# Altium schematic sheet RasCNC_board.SchDoc: RP2040 CNC
size C; Author: AM; CompanyName: Expatria Technologies; DrawnBy: A.Marles; Engineer: AM; Organization: Expatria Technolgoies; Address1: Schematic; DocumentNumber: 11; SheetNumber: 11; SheetTotal: 13
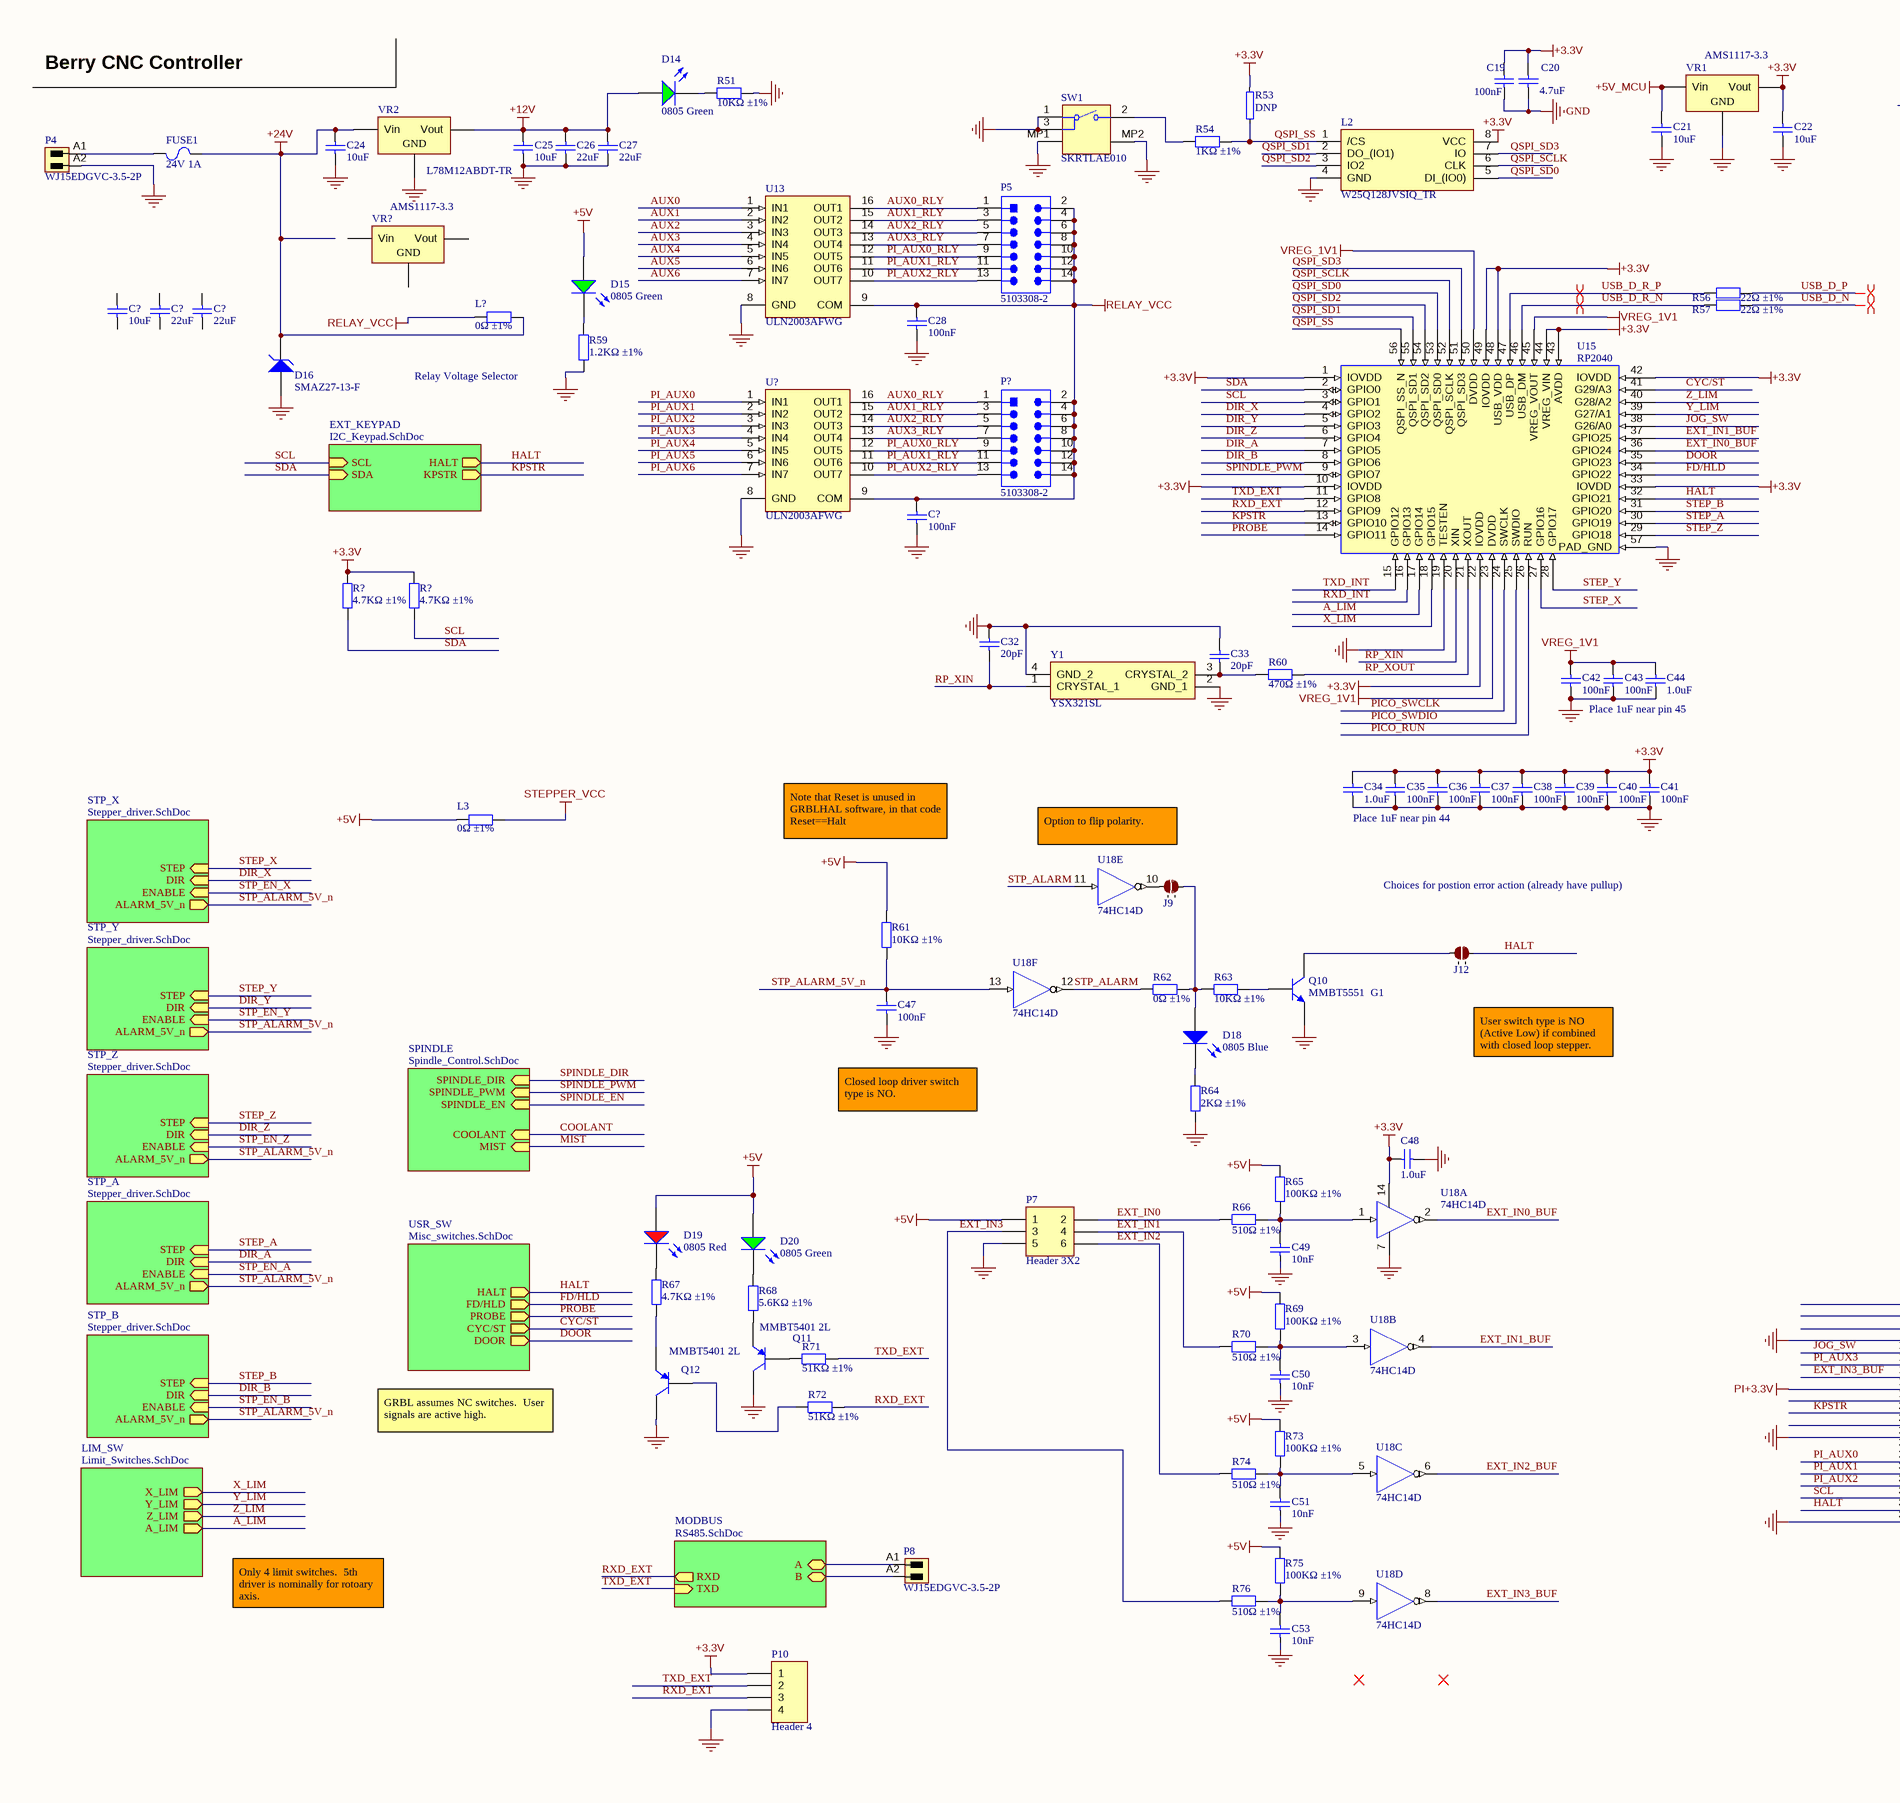
[diagram p0: RasCNC_board.SchDoc, left]
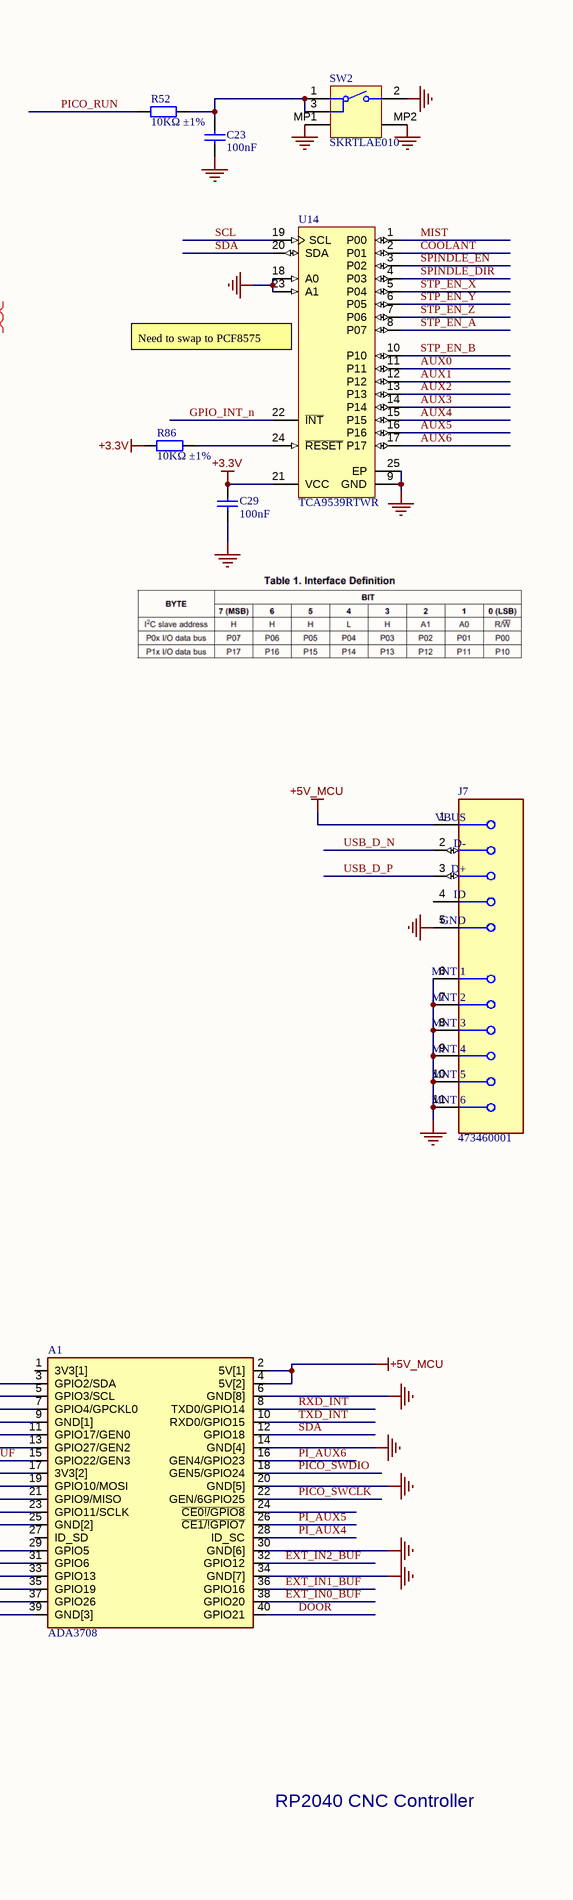
[diagram p1: RasCNC_board.SchDoc, right]

## Parts
(Parts that share a designator on the sheet are numbered #1, #2 ... from top to bottom, then left to right.)
A1  ADA3708  [ADA3708_RPI-ZERO]
C19  100nF  [0402_C]
C20  4.7uF  [0402_C]
C21  10uF  [1206_C]
C22  10uF  [1206_C]
C23  100nF  [0402_C]
C24  10uF  [1206_C]
C25  10uF  [1206_C]
C26  22uF  [0805_C]
C27  22uF  [0805_C]
C28  100nF  [0603_C]
C29  100nF  [0402_C]
C32  20pF  [0402_C]
C33  20pF  [0402_C]
C34  1.0uF  [0402_C]
C35  100nF  [0402_C]
C36  100nF  [0402_C]
C37  100nF  [0402_C]
C38  100nF  [0402_C]
C39  100nF  [0402_C]
C40  100nF  [0402_C]
C41  100nF  [0402_C]
C42  100nF  [0402_C]
C43  100nF  [0402_C]
C44  1.0uF  [0402_C]
C47  100nF  [0402_C]
C48  1.0uF  [0402_C]
C49  10nF  [0402_C]
C50  10nF  [0402_C]
C51  10nF  [0402_C]
C53  10nF  [0402_C]
C?#1  10uF  [1206_C]
C?#2  22uF  [0805_C]
C?#3  22uF  [0805_C]
C?#4  100nF  [0603_C]
D14  0805 Green  [0805_LED_S1]
D15  0805 Green  [0805_LED_S1]
D16  SMAZ27-13-F  [DIOM5226X240N]
D18  0805 Blue  [0805_LED_S1]
D19  0805 Red  [0805_LED_S1]
D20  0805 Green  [0805_LED_S1]
FUSE1  24V 1A  [1206_C]
J7  473460001  [FP-473460001-MFG]
J9  2 way net solder junction - Normally Open  [2waySolder_NO]  (value not drawn)  (no BOM)
J12  2 way net solder junction - Normally Open  [2waySolder_NO]  (value not drawn)  (no BOM)
L2  W25Q128JVSIQ_TR  [SOIC127P780X195-8N]
L3  0Ω ±1%  [0402_R]
L?  0Ω ±1%  [0402_R]
P4  WJ15EDGVC-3.5-2P  [SL_3_50_180G_02]
P5  5103308-2  [TECO-5103308-2_V]
P7  Header 3X2  [HDR2X3]
P8  WJ15EDGVC-3.5-2P  [SL_3_50_180G_02]
P10  Header 4  [HDR1X4]
P?  5103308-2  [TECO-5103308-2_V]
Q10  MMBT5551  G1  [SOT-23(SOT-23-3)]
Q11  MMBT5401 2L  [SOT-23(SOT-23-3)]
Q12  MMBT5401 2L  [SOT-23(SOT-23-3)]
R51  10KΩ ±1%  [0402_R]
R52  10KΩ ±1%  [0402_R]
R53  DNP  [0402]
R54  1KΩ ±1%  [0402_R]
R56  22Ω ±1%  [0402_R]
R57  22Ω ±1%  [0402_R]
R59  1.2KΩ ±1%  [0402_R]
R60  470Ω ±1%  [0402_R]
R61  10KΩ ±1%  [0402_R]
R62  0Ω ±1%  [0402_R]
R63  10KΩ ±1%  [0402_R]
R64  2KΩ ±1%  [0402_R]
R65  100KΩ ±1%  [0402_R]
R66  510Ω ±1%  [0402_R]
R67  4.7KΩ ±1%  [0402_R]
R68  5.6KΩ ±1%  [0402_R]
R69  100KΩ ±1%  [0402_R]
R70  510Ω ±1%  [0402_R]
R71  51KΩ ±1%  [0402_R]
R72  51KΩ ±1%  [0402_R]
R73  100KΩ ±1%  [0402_R]
R74  510Ω ±1%  [0402_R]
R75  100KΩ ±1%  [0402_R]
R76  510Ω ±1%  [0402_R]
R86  10KΩ ±1%  [0402_R]
R?#1  4.7KΩ ±1%  [0402_R]
R?#2  4.7KΩ ±1%  [0402_R]
SW1  SKRTLAE010  [ALPS-SKRTLAE010_V]
SW2  SKRTLAE010  [ALPS-SKRTLAE010_V]
U13  ULN2003AFWG  [SOIC-16_150mil]
U14  TCA9539RTWR  [RTW0024B_V]
U15  RP2040  [RP2040]
U18  74HC14D  [SOIC-14_150mil]  (parts A,B,C,D,E,F of 6)
U?  ULN2003AFWG  [SOIC-16_150mil]
VR1  AMS1117-3.3  [SOT-223]
VR2  L78M12ABDT-TR  [TO-252-2-180]
VR?  AMS1117-3.3  [SOT-223]
Y1  YSX321SL  [YSX321SL]

## Sub-sheets
EXT_KEYPAD = I2C_Keypad.SchDoc: HALT (out), SCL (in), KPSTR (out), SDA (in)
LIM_SW = Limit_Switches.SchDoc: Y_LIM (out), Z_LIM (out), X_LIM (out), A_LIM (out)
MODBUS = RS485.SchDoc: A (bidir), B (bidir), RXD (out), TXD (in)
SPINDLE = Spindle_Control.SchDoc: COOLANT (in), MIST (in), SPINDLE_EN (in), SPINDLE_DIR (in), SPINDLE_PWM (in)
STP_A = Stepper_driver.SchDoc: ALARM_5V_n (out), STEP (in), DIR (in), ENABLE (in)
STP_B = Stepper_driver.SchDoc: ALARM_5V_n (out), STEP (in), DIR (in), ENABLE (in)
STP_X = Stepper_driver.SchDoc: ALARM_5V_n (out), STEP (in), DIR (in), ENABLE (in)
STP_Y = Stepper_driver.SchDoc: ALARM_5V_n (out), STEP (in), DIR (in), ENABLE (in)
STP_Z = Stepper_driver.SchDoc: ALARM_5V_n (out), STEP (in), DIR (in), ENABLE (in)
USR_SW = Misc_switches.SchDoc: HALT (out), FD/HLD (out), PROBE (out), CYC/ST (out), DOOR (out)

## Nets
+3.3V: C19.2 C20.2 C22.2 C29.2 C34.2 C35.2 C36.2 C37.2 C38.2 C39.2 C40.2 C41.2 C48.1 L2.8(VCC) P10.1 R53.2 R86.2 R?#1.2 R?#2.2 U14.21(VCC) U15.1(IOVDD) U15.10(IOVDD) U15.22(IOVDD) U15.33(IOVDD) U15.42(IOVDD) U15.43(AVDD) U15.44(VREG_VIN) U15.48(USB_VDD) U15.49(IOVDD) U18.14(VDD) VR1.2(Vout)
+5V: D15.A D19.A D20.A L3.1 P7.1 R61.2 R65.2 R69.2 R73.2 R75.2
+5V_MCU: A1.2(5V[1]) A1.4(5V[2]) C21.2 J7.1(VBUS) VR1.3(Vin)
+12V: C25.2 C26.2 C27.2 D14.A VR2.3(Vout)
+24V: C24.2 D16.2(K) FUSE1.2 L?.2 VR2.1(Vin)
GND: A1.6(GND[8]) A1.9(GND[1]) A1.14(GND[4]) A1.20(GND[5]) A1.25(GND[2]) A1.30(GND[6]) A1.34(GND[7]) A1.39(GND[3]) C19.1 C20.1 C21.1 C22.1 C23.1 C24.1 C25.1 C26.1 C27.1 C28.1 C29.1 C32.2 C33.2 C34.1 C35.1 C36.1 C37.1 C38.1 C39.1 C40.1 C41.1 C42.1 C43.1 C44.1 C47.1 C48.2 C49.1 C50.1 C51.1 C53.1 C?#4.1 D16.1(A) J7.5(GND) J7.6(MNT_1) J7.7(MNT_2) J7.8(MNT_3) J7.9(MNT_4) J7.10(MNT_5) J7.11(MNT_6) L2.4(GND) P4.A2 P7.5 P10.4 Q10.2(E) Q11.3(C) Q12.3(C) R51.1 R59.1 R64.1 SW1.1 SW1.3 SW1.MP1 SW1.MP2 SW2.2 SW2.MP1 SW2.MP2 U13.8(GND) U14.9(GND) U14.18(A0) U14.23(A1) U14.25(EP) U15.19(TESTEN) U15.57(PAD_GND) U18.7(GND) U?.8(GND) VR1.1(GND) VR2.2(GND) Y1.2(GND_1) Y1.4(GND_2)
PI+3.3V: A1.17(3V3[2])
RELAY_VCC: C28.2 C?#4.2 L?.1 P5.2 P5.4 P5.6 P5.8 P5.10 P5.12 P5.14 P?.2 P?.4 P?.6 P?.8 P?.10 P?.12 P?.14 U13.9(COM) U?.9(COM)
STEPPER_VCC: L3.2
VREG_1V1: C42.2 C43.2 C44.2 U15.23(DVDD) U15.45(VREG_VOUT) U15.50(DVDD)
A_LIM: U15.17(GPIO14) ; sheet LIM_SW/A_LIM
AUX0: U13.1(IN1) U14.11(P11)
AUX0_RLY: P5.1 P?.1 U13.16(OUT1) U?.16(OUT1)
AUX1: U13.2(IN2) U14.12(P12)
AUX1_RLY: P5.3 P?.3 U13.15(OUT2) U?.15(OUT2)
AUX2: U13.3(IN3) U14.13(P13)
AUX2_RLY: P5.5 P?.5 U13.14(OUT3) U?.14(OUT3)
AUX3: U13.4(IN4) U14.14(P14)
AUX3_RLY: P5.7 P?.7 U13.13(OUT4) U?.13(OUT4)
AUX4: U13.5(IN5) U14.15(P15)
AUX5: U13.6(IN6) U14.16(P16)
AUX6: U13.7(IN7) U14.17(P17)
COOLANT: U14.2(P01) ; sheet SPINDLE/COOLANT
CYC/ST: U15.41(G29/A3) ; sheet USR_SW/CYC/ST
DIR_A: U15.7(GPIO5) ; sheet STP_A/DIR
DIR_B: U15.8(GPIO6) ; sheet STP_B/DIR
DIR_X: U15.4(GPIO2) ; sheet STP_X/DIR
DIR_Y: U15.5(GPIO3) ; sheet STP_Y/DIR
DIR_Z: U15.6(GPIO4) ; sheet STP_Z/DIR
DOOR: A1.40(GPIO21) U15.35(GPIO23) ; sheet USR_SW/DOOR
EXT_IN0: P7.2 R66.1
EXT_IN0_BUF: A1.38(GPIO20) U15.36(GPIO24) U18.2(Y)
EXT_IN1: P7.4 R70.1
EXT_IN1_BUF: A1.36(GPIO16) U15.37(GPIO25) U18.4(Y)
EXT_IN2: P7.6 R74.1
EXT_IN2_BUF: A1.32(GPIO12) U18.6(Y)
EXT_IN3: P7.3 R76.1
EXT_IN3_BUF: A1.15(GPIO22/GEN3) U18.8(Y)
FD/HLD: U15.34(GPIO22) ; sheet USR_SW/FD/HLD
GPIO_INT_n: U14.22(~{INT})
HALT: A1.37(GPIO26) J12.2 U15.32(GPIO21) ; sheet USR_SW/HALT, sheet EXT_KEYPAD/HALT
JOG_SW: A1.11(GPIO17/GEN0) U15.38(G26/A0)
KPSTR: A1.21(GPIO9/MISO) U15.13(GPIO10) ; sheet EXT_KEYPAD/KPSTR
MIST: U14.1(P00) ; sheet SPINDLE/MIST
PI_AUX0: A1.29(GPIO5) U?.1(IN1)
PI_AUX0_RLY: P5.9 P?.9 U13.12(OUT5) U?.12(OUT5)
PI_AUX1: A1.31(GPIO6) U?.2(IN2)
PI_AUX1_RLY: P5.11 P?.11 U13.11(OUT6) U?.11(OUT6)
PI_AUX2: A1.33(GPIO13) U?.3(IN3)
PI_AUX2_RLY: P5.13 P?.13 U13.10(OUT7) U?.10(OUT7)
PI_AUX3: A1.13(GPIO27/GEN2) U?.4(IN4)
PI_AUX4: A1.28(ID_SC) U?.5(IN5)
PI_AUX5: A1.26(~{CE1/!GPIO7}) U?.6(IN6)
PI_AUX6: A1.16(GEN4/GPIO23) U?.7(IN7)
PICO_RUN: R52.2 U15.26(RUN)
PICO_SWCLK: A1.22(GEN/6GPIO25) U15.24(SWCLK)
PICO_SWDIO: A1.18(GEN5/GPIO24) U15.25(SWDIO)
PROBE: U15.14(GPIO11) ; sheet USR_SW/PROBE
QSPI_SCLK: L2.6(CLK) U15.52(QSPI_SCLK)
QSPI_SD0: L2.5(DI_(IO0)) U15.53(QSPI_SD0)
QSPI_SD1: L2.2(DO_(IO1)) U15.55(QSPI_SD1)
QSPI_SD2: L2.3(IO2) U15.54(QSPI_SD2)
QSPI_SD3: L2.7(IO) U15.51(QSPI_SD3)
QSPI_SS: L2.1(/CS) R53.1 R54.2 U15.56(QSPI_SS_N)
RP_XIN: C32.1 U15.20(XIN) Y1.1(CRYSTAL_1)
RP_XOUT: R60.2 U15.21(XOUT)
RXD_EXT: P10.3 R72.1 U15.12(GPIO9) ; sheet MODBUS/RXD
RXD_INT: A1.8(TXD0/GPIO14) U15.16(GPIO13)
SCL: A1.35(GPIO19) R?#2.1 U14.19(SCL) U15.3(GPIO1) ; sheet EXT_KEYPAD/SCL
SDA: A1.12(GPIO18) R?#1.1 U14.20(SDA) U15.2(GPIO0) ; sheet EXT_KEYPAD/SDA
SPINDLE_DIR: U14.4(P03) ; sheet SPINDLE/SPINDLE_DIR
SPINDLE_EN: U14.3(P02) ; sheet SPINDLE/SPINDLE_EN
SPINDLE_PWM: U15.9(GPIO7) ; sheet SPINDLE/SPINDLE_PWM
STEP_A: U15.30(GPIO19) ; sheet STP_A/STEP
STEP_B: U15.31(GPIO20) ; sheet STP_B/STEP
STEP_X: U15.27(GPIO16) ; sheet STP_X/STEP
STEP_Y: U15.28(GPIO17) ; sheet STP_Y/STEP
STEP_Z: U15.29(GPIO18) ; sheet STP_Z/STEP
STP_ALARM: R62.2 U18.11(A) U18.12(Y)
STP_ALARM_5V_n: C47.2 R61.1 U18.13(A) ; sheet STP_X/ALARM_5V_n, sheet STP_Y/ALARM_5V_n, sheet STP_Z/ALARM_5V_n, sheet STP_A/ALARM_5V_n, sheet STP_B/ALARM_5V_n
STP_EN_A: U14.8(P07) ; sheet STP_A/ENABLE
STP_EN_B: U14.10(P10) ; sheet STP_B/ENABLE
STP_EN_X: U14.5(P04) ; sheet STP_X/ENABLE
STP_EN_Y: U14.6(P05) ; sheet STP_Y/ENABLE
STP_EN_Z: U14.7(P06) ; sheet STP_Z/ENABLE
TXD_EXT: P10.2 R71.2 U15.11(GPIO8) ; sheet MODBUS/TXD
TXD_INT: A1.10(RXD0/GPIO15) U15.15(GPIO12)
USB_D_N: J7.2(D-) R57.1
USB_D_P: J7.3(D+) R56.1
USB_D_R_N: R57.2 U15.46(USB_DM)
USB_D_R_P: R56.2 U15.47(USB_DP)
X_LIM: U15.18(GPIO15) ; sheet LIM_SW/X_LIM
Y_LIM: U15.39(G27/A1) ; sheet LIM_SW/Y_LIM
Z_LIM: U15.40(G28/A2) ; sheet LIM_SW/Z_LIM
NetC23_2: C23.2 R52.1 SW2.1 SW2.3
NetC33_1: C33.1 R60.1 Y1.3(CRYSTAL_2)
NetC49_2: C49.2 R65.1 R66.2 U18.1(A)
NetC50_2: C50.2 R69.1 R70.2 U18.3(A)
NetC51_2: C51.2 R73.1 R74.2 U18.5(A)
NetC53_2: C53.2 R75.1 R76.2 U18.9(A)
NetD14_K: D14.K R51.2
NetD15_K: D15.K R59.2
NetD18_A: D18.A J9.2 R62.1 R63.1
NetD18_K: D18.K R64.2
NetD19_K: D19.K R67.2
NetD20_K: D20.K R68.2
NetFUSE1_1: FUSE1.1 P4.A1
NetJ9_1: J9.1 U18.10(Y)
NetJ12_1: J12.1 Q10.3(C)
NetP8_A1: P8.A1 ; sheet MODBUS/A
NetP8_A2: P8.A2 ; sheet MODBUS/B
NetQ10_1: Q10.1(B) R63.2
NetQ11_1: Q11.1(B) R71.1
NetQ11_2: Q11.2(E) R68.1
NetQ12_1: Q12.1(B) R72.2
NetQ12_2: Q12.2(E) R67.1
NetR54_1: R54.1 SW1.2
NetR86_1: R86.1 U14.24(~{RESET})

Not connected (* = marked no-connect by the designer): A1 1(3V3[1]) 3(GPIO2/SDA) 5(GPIO3/SCL) 7(GPIO4/GPCKL0) 19(GPIO10/MOSI) 23(GPIO11/SCLK) 24(~{CE0!/GPIO8}) 27(ID_SD); C?#1 1 2; C?#2 1 2; C?#3 1 2; J7 4(ID); VR? 1(GND) 2(Vout) 3(Vin)

## Layout directives
differential pair: USB_D_N, USB_D_P, USB_D_R_N, USB_D_R_P

## Notes on the sheet
- Berry CNC Controller
- (near U14) Need to swap to PCF8575
- Relay Voltage Selector
- Place 1uF near pin 45
- Note that Reset is unused in GRBLHAL software, in that code Reset==Halt
- Option to flip polarity.
- Place 1uF near pin 44
- Choices for postion error action (already have pullup)
- User switch type is NO (Active Low) if combined with closed loop stepper.
- Closed loop driver switch type is NO.
- GRBL assumes NC switches.  User signals are active high.
- Only 4 limit switches.  5th driver is nominally for rotoary axis.
- RP2040 CNC Controller
- Expatria Technologies
- SHEET
- PROJECT
- REV
- 1136 Glade Court
- Port Coquitlam, BC V3B 1R5
- EMAIL: INFO@EXPATRIA.CA
- SIZE
- ENGR
- C
- MODIFIED
- DOCUMENT
- /
- Copyright Expatria Technologies 2021.  This document describes Open Hardware and is licensed under the CERN-OHL-P  v2.  No warranty is implied or expressed.

## Library data of the parts
A1 = ADA3708: Raspberry Pi Zero WH _Zero W with Headers_; MP: ADA3708; Availability: Unavailable; Package: None; MF: Raspberry Pi; Value: *; Price: None; SnapEDA_Link: https://www.snapeda.com/parts/ADA3708/Raspberry%20Pi/view-part/2770118/?ref=snap
C19 C23 C29 C35-C43 C47 = 0402 100nF (104) 10% 16V: Chip capacitors; Manufacturer: Samsung Electro-Mechanics; PartNumber: CL05B104KO5NNNC; Tolerance: 10%; Voltage: 16V; ComponentLink1Description: Supplier link; ComponentLink1URL: http://www.szlcsc.com/product/details_1877.html; Package: 0402; Supplier: LC; SuppliersPartNumber: C1525; Capacitance: 100nF
C20 = 0402 4.7uF (475) 20% 10V: Chip capacitor; Manufacturer: Samsung Electro-Mechanics; PartNumber: CL05A475MP5NRNC; Tolerance: 20%; Voltage: 10V; ComponentLink1Description: Supplier link; ComponentLink1URL: http://www.szlcsc.com/product/details_24469.html; Package: 0402; Supplier: LC; SuppliersPartNumber: C23733; Capacitance: 4.7uF
C21 C22 C24 C25 C?#1 = 1206 10uF (106) 10% 50V: Chip capacitors; Manufacturer: Samsung Electro-Mechanics; PartNumber: CL31A106KBHNNNE; Tolerance: 10%; Voltage: 50V; ComponentLink1Description: Supplier link; ComponentLink1URL: http://www.szlcsc.com/product/details_14236.html; Package: 1206; Supplier: LC; SuppliersPartNumber: C13585; Capacitance: 10uF
C26 C27 C?#2 C?#3 = 0805 22uF (226) 20% 25V: Chip capacitors; Manufacturer: Samsung Electro-Mechanics; PartNumber: CL21A226MAQNNNE; Tolerance: 20%; Voltage: 25V; ComponentLink1Description: Supplier link; ComponentLink1URL: http://www.szlcsc.com/product/details_46786.html; Package: 0805; Supplier: LC; SuppliersPartNumber: C45783; Capacitance: 22uF
C28 C?#4 = 0603 100nF (104) 10% 50V: Chip capacitors; Manufacturer: YAGEO; PartNumber: CC0603KRX7R9BB104; Tolerance: 10%; Voltage: 50V; ComponentLink1Description: Supplier link; ComponentLink1URL: http://www.szlcsc.com/product/details_15331.html; Package: 0603; Supplier: LC; SuppliersPartNumber: C14663; Capacitance: 100nF
C32 C33 = 0402 20pF (200) 5% 50V: Chip capacitors; Manufacturer: Guangdong Fenghua Advanced Tech; PartNumber: 0402CG200J500NT; Tolerance: 5%; Voltage: 50V; ComponentLink1Description: Supplier link; ComponentLink1URL: http://www.szlcsc.com/product/details_1906.html; Package: 0402; Supplier: LC; SuppliersPartNumber: C1554; Capacitance: 20pF
C34 C44 C48 = 0402 1.0uF (105) 10% 25V: Chip capacitor; Manufacturer: Samsung Electro-Mechanics; PartNumber: CL05A105KA5NQNC; Capacitance: 1uF; Tolerance: 10%; Voltage: 25V; ComponentLink1Description: Supplier link; ComponentLink1URL: http://www.szlcsc.com/product/details_53938.html; Package: 0402; Supplier: LC; SuppliersPartNumber: C52923
C49-C51 C53 = 0402 10nF (103) 10% 50V: Chip capacitors; Manufacturer: Samsung Electro-Mechanics; PartNumber: CL05B103KB5NNNC; Tolerance: 10%; Voltage: 50V; ComponentLink1Description: Supplier link; ComponentLink1URL: http://www.szlcsc.com/product/details_15869.html; Package: 0402; Supplier: LC; SuppliersPartNumber: C15195; Capacitance: 10nF
D14 D15 D20 = 0805 LED Green: LED; ComponentLink1Description: 供应商链接; ComponentLink1URL: http://www.szlcsc.com/product/details_2670.html; Package: 0805; Supplier: LC; SuppliersPartNumber: C2297; Color: Green
D16 = BZT52C27: 27V ±5% 1W 500nA @ 20.5V SMA(DO-214AC) Zener Diodes RoHS; ComponentLink1Description: 供应商链接; ComponentLink1URL: http://www.szlcsc.com/product/details_8541.html; Package: SMA(DO-214AC); Supplier: LC; SuppliersPartNumber: C155318
D18 = 0805 LED Blue: LED; ComponentLink1Description: 供应商链接; ComponentLink1URL: http://www.szlcsc.com/product/details_2666.html; Package: 0805; Supplier: LC; SuppliersPartNumber: C2293; Color: Blue
D19 = 0805 LED Red: LED; PartNumber: FC-2012HRK-620D; Manufacturer: Foshan NationStar Optoelectronics; ComponentLink1Description: 供应商链接; ComponentLink1URL: http://www.szlcsc.com/product/details_2668.html; Package: 0805; Supplier: LC; SuppliersPartNumber: C84256; Color: Red
FUSE1 = JK-nSMD050-24: 24V 1A 0.1s 1206 PTC Resettable Fuses RoHS; Manufacturer: Jinrui Electronic Materials Co.; Package: 1206; Supplier: LC; SuppliersPartNumber: C369160; PartNumber: JK-nSMD050-24
J7 = CMP-2000-05246-2: CONN RCPT USB2.0 MICRO B SMD R/A; Manufacturer: Molex; Conn Orientation: Right Angle; Is Female: yes; Shielding: true; Pitch: 0.65mm; Number Of Contacts: 5; Voltage Rating: 30V; Current Rating: 1.8A; Device Class L2: USB Connectors; Digikey Description: CONN RCPT USB2.0 MICRO B SMD R/A; Height: 2.945mm; RoHS: TRUE; ComponentLink2Description: Datasheet; Octopart: https://octopart.com/47346-0001-molex-7164928; Automotive: No; Package: 0; Category: Conn; Device Class L1: Connectors; Usb Standard: USB 2.0; Temperature: -30°C to +85°C; Temperature Range Low: -30°C; Footprint Url: https://www.molex.com/pdm_docs/sd/473460001_sd.pdf; ComponentLink2URL: https://www.molex.com/webdocs/datasheets/pdf/en-us/0473460001_IO_CONNECTORS.pdf; Lead Free: Yes; Manufacturer Part Number: 473460001; Contact Material: Gold,Nickel; Temperature Range High: +85°C; Device Class L3: unset; SuppliersPartNumber: C132560
J9 J12 = 2waySolderNO: ComponentLink1URL: http://www.edatools.cz/addons; ComponentLink1Description: Source
L2 = W25Q128JVSIQ_TR: Inductor; Manufacturer_Name: Winbond; Manufacturer_Part_Number: W25Q128JVSIQ TR; Datasheet Link: http://www.winbond.com/resource-files/w25q128jv%20spi%20revc%2011162016.pdf; Height: 1.95mm; Mouser Part Number: 454-W25Q128JVSIQTR; Mouser Price/Stock: https://www.mouser.co.uk/ProductDetail/Winbond/W25Q128JVSIQ-TR?qs=qSfuJ%252Bfl%2Fd7vTyLA9kNdGw%3D%3D; Arrow Part Number: W25Q128JVSIQ TR; Arrow Price/Stock: https://www.arrow.com/en/products/w25q128jvsiqtr/winbond-electronics?region=nac; SuppliersPartNumber: C97521
L3 L? R62 = 0402 0R (0R0) 1%: Chip resistor; Manufacturer: Uniroyal Elec; PartNumber: 0402WGF0000TCE; Power: 1/16W; Package: 0402; Supplier: LC; SuppliersPartNumber: C17168; ComponentLink1Description: Supplier link; ComponentLink1URL: http://www.szlcsc.com/product/details_17853.html; Resistance: 0Ω; Tolerance: 1%
P4 P8 = CMP-1559-00901-1: Header,Male Pin,Covered(4 Sided) 2 1 0.138"（3.50mm） 2 P=3.5mm Pluggable System Terminal Block RoHS; Manufacturer: Weidmueller; UL_94_flammability_rating: V-0; Pitch_mm: 3.5 mm; Side_termination_characteristic: closed side; Pitch_inch: 0.138 inch; Solder_pin_length_mm: 3.2 mm; Short_text_for_material: SL 3.50/02/180G 3.2SN OR BX; ComponentLink1Description: Manufacturer URL; ComponentLink1URL: http://www.weidmueller.com/; PartNumber: WJ15EDGVC-3.5-2P; Revision: V1; PackageReference: SL_3_50_180G_02; Packaging: Box
P5 P? = CMP-2000-05623-1: Male Header, Pitch 2.54 mm, 2 x 7 Position, Height 9.8552 mm, Tail Length 3.048 mm, -65 to 105 degC, RoHS, Rail/Tube; Manufacturer: TE Connectivity; Featured Product: AMP-LATCHRibbonCableConnectors; Mating Products: 1658527-5-ND / -CONNRCPT14POS.100POLARGOLD / 1658526-9-ND / -CONNRCPT14POSVERTGOLDW/SR / 1658526-8-ND / -CONNRCPT14POSVERTGOLD / ASC14B-ND / -CONNIDCSOCKET14POSGOLD / ASC14H-ND / -CONNIDCSOCKET14POS15GOLD / AKC14B-ND / -CONNIDCSKT14POSW/POLGOLD / AKC14H-ND / -CONNIDCSKT14POSW/POL15GOLD / 487223-2-ND / -014HOUSINGFFCRCPT100CLDR; Other Names: A33161; Number of Positions: 14; Dynamic Catalog: AMP-LatchSeries; Catalog Drawings: LowProfileShroudedStraight; Pitch: 0.100"(2.54mm); 3D Model: 5103308-2.pdf; Connector Type: Header,Shrouded; Number of Positions Loaded: All; RoHS Information: 5103308-2StatementofCompliance; Datasheet URL: http://www.te.com/commerce/DocumentDelivery/DDEController?Action=srchrtrv&DocNm=5103308&DocType=Customer+Drawing&DocLang=English&DocFormat=pdf&PartCntxt=5103308-2; Mounting Type: ThroughHole; Packaging: Tube; Standard Package: 100; Category: Connectors,Interconnects; Number of Rows: 2; Package Description: Male Header, Pitch 2.54 mm, 2 x 7 Position, Height 9.8552 mm, Tail Length 3.048 mm; Termination: Solder; Contact Mating Length: 0.240"(6.10mm); Color: Black; Contact Finish: GoldorGold-Palladium; Manufacturer URL: http://www.te.com/; Family: RectangularConnectors-Headers,MalePins; Row Spacing: 0.100"(2.54mm); Package Reference: 5103308-2; Contact Type: MalePin; Contact Finish Thickness: 15µin(0.38µm); Mounting Technology: ThroughHole; Series: AMP-Latch; Datasheet Version: Rev. E, 03/2011
P7 = Header 3X2: Header, 3-Pin, Dual row; Publisher: Altium Limited
P10 = Header 4: Header, 4-Pin; Publisher: Altium Limited
Q10 = SOT-23 MMBT5551  G1: 三极管; ComponentLink1Description: 供应商链接; ComponentLink1URL: http://www.szlcsc.com/product/details_2502.html; Package: SOT-23; Supplier: LC; SuppliersPartNumber: C2145
Q11 Q12 = SOT-23 MMBT5401 2L: 三极管; ComponentLink1Description: 供应商链接; ComponentLink1URL: http://www.szlcsc.com/product/details_8818.html; Package: SOT-23; Supplier: LC; SuppliersPartNumber: C8326
R51 R52 R61 R63 R86 = 0402 10K (1002) 1%: Chip resistor; Manufacturer: Uniroyal Elec; PartNumber: 0402WGF1002TCE; Power: 1/16W; ComponentLink1Description: Supplier link; ComponentLink1URL: http://www.szlcsc.com/product/details_26487.html; Package: 0402; Supplier: LC; SuppliersPartNumber: C25744; Resistance: 10KΩ; Tolerance: 1%
R53 = RES: Resistor, ±5%, 0.05W; Part Number: R0201-0R; Part number IPS: 00000003245; Value: 0R; Note: Chip Res 5%; Artikkelnr Noca: N.A.; Manufacturer: *; Manufacturer Part Number: *; ComponentLink1URL: *; ComponentLink1Description: Datasheet; ComponentLink2URL: *; ComponentLink2Description: Supplier link; HelpURL: *; Footprint Doc: 0201; LatestRevisionDate: 2017-11-09; Pin Count: 2; Publisher: Nordic Semiconductor; Published: 2014-11-13; Supplier 1: *; Supplier Part Number 1: *; Supplier 2: *; Supplier Part Number 2: *
R54 = 0402 1K (1001) 1%: Chip resistor; Manufacturer: Uniroyal Elec; PartNumber: 0402WGF1001TCE; Power: 1/16W; ComponentLink1Description: Supplier link; ComponentLink1URL: http://www.szlcsc.com/product/details_12256.html; Package: 0402; Supplier: LC; SuppliersPartNumber: C11702; Resistance: 1KΩ; Tolerance: 1%
R56 R57 = 0402 22R (22R0) 1%: Chip resistor; Manufacturer: Uniroyal Elec; PartNumber: 0402WGF220JTCE; Power: 1/16W; ComponentLink1Description: Supplier link; ComponentLink1URL: http://www.szlcsc.com/product/details_25835.html; Package: 0402; Supplier: LC; SuppliersPartNumber: C25092; Resistance: 22Ω; Tolerance: 1%
R59 = 0402 1.2K (1201) 1%: Chip resistor; Manufacturer: Uniroyal Elec; PartNumber: 0402WGF1201TCE; Power: 1/16W; ComponentLink1Description: Supplier link; ComponentLink1URL: http://www.szlcsc.com/product/details_26605.html; Package: 0402; Supplier: LC; SuppliersPartNumber: C25862; Resistance: 1.2KΩ; Tolerance: 1%
R60 = 0402 470R (4700) 1%: Chip resistor; Manufacturer: Uniroyal Elec; PartNumber: 0402WGF4700TCE; Power: 1/16W; ComponentLink1Description: Supplier link; ComponentLink1URL: http://www.szlcsc.com/product/details_25860.html; Package: 0402; Supplier: LC; SuppliersPartNumber: C25117; Resistance: 470Ω; Tolerance: 1%
R64 = 0402 2K (2001) 1%: Chip resistor; Manufacturer: Uniroyal Elec; PartNumber: 0402WGF2001TCE; Power: 1/16W; ComponentLink1Description: Supplier link; ComponentLink1URL: http://www.szlcsc.com/product/details_4516.html; Package: 0402; Supplier: LC; SuppliersPartNumber: C4109; Resistance: 2KΩ; Tolerance: 1%
R65 R69 R73 R75 = 0402 100K (1003) 1%: Chip resistor; Manufacturer: Uniroyal Elec; PartNumber: 0402WGF1003TCE; Power: 1/16W; ComponentLink1Description: Supplier link; ComponentLink1URL: http://www.szlcsc.com/product/details_26484.html; Package: 0402; Supplier: LC; SuppliersPartNumber: C25741; Resistance: 100KΩ; Tolerance: 1%
R66 R70 R74 R76 = 0402 510R (5100) 1%: Chip resistor; Manufacturer: Uniroyal Elec; PartNumber: 0402WGF5100TCE; Power: 1/16W; ComponentLink1Description: Supplier link; ComponentLink1URL: http://www.szlcsc.com/product/details_25866.html; Package: 0402; Supplier: LC; SuppliersPartNumber: C25123; Resistance: 510Ω; Tolerance: 1%
R67 R?#1 R?#2 = 0402 4.7K (4701) 1%: Chip resistor; Manufacturer: Uniroyal Elec; PartNumber: 0402WGF4701TCE; Power: 1/16W; ComponentLink1Description: Supplier link; ComponentLink1URL: http://www.szlcsc.com/product/details_26643.html; Package: 0402; Supplier: LC; SuppliersPartNumber: C25900; Resistance: 4.7KΩ; Tolerance: 1%
R68 = 0402 5.6K (5601) 1%: Chip resistor; Manufacturer: Uniroyal Elec; PartNumber: 0402WGF5601TCE; Power: 1/16W; ComponentLink1Description: Supplier link; ComponentLink1URL: http://www.szlcsc.com/product/details_26651.html; Package: 0402; Supplier: LC; SuppliersPartNumber: C25908; Resistance: 5.6KΩ; Tolerance: 1%
R71 R72 = 0402 51K (5102) 1%: Chip resistor; Manufacturer: Uniroyal Elec; PartNumber: 0402WGF5102TCE; Power: 1/16W; ComponentLink1Description: Supplier link; ComponentLink1URL: http://www.szlcsc.com/product/details_26537.html; Package: 0402; Supplier: LC; SuppliersPartNumber: C25794; Resistance: 51KΩ; Tolerance: 1%
SW1 SW2 = CMP-2000-07073-2: Side Push Type, 250 V, -40 to 90 degC, 3-Pin SMD, RoHS, Tape and Reel; Manufacturer: ALPS; Operating Force: 1.6N; Folder: Unified Components\Components\New Releases\New\; Maximum Current Rating: 0.05@12VDCA; RevisionId: 1; Pole Throw Configuration: SPST; Switch Configuration: N.O.; AccessRights: 2147483647; Maximum DC Voltage Rating: 12V; ContentType: Unified Component; Rad Hard: No; Mounting: SurfaceMount; Datasheet URL: http://www.alps.com/prod/info/E/PDF/Tact/SurfaceMount/SKRT/SKRT.PDF; Manufacturer URL: http://www.alps.com/e/; ReleaseDate: 22/09/2017 06:13:25 AM; ItemHRID: CMP-2000-07073; ContentTypeGUID: CB3C11C4-E317-11DF-B822-12313F0024A2; LifeCycle: Released; ItemGUID: EAC55BEC-37DC-4BDB-8BA7-D75E6D5C3D75; Packaging: Tape&Reel; Package Reference: SKRTLAE010; FolderGUID: B7F4506A-9127-42E7-A087-46FE7B18D116; Datasheet Version: 06/2015; Mounting Technology: SurfaceMount; LifeCycleStateGUID: 61E382EE-6656-4F12-9E24-BE9327104A25; Package Description: 3-Pin Surface Mount Device, Body 4.5 x 3.55 mm, Pitch 1.225 mm; SuppliersPartNumber: C110293
U13 U? = ULN2003AFWG_[C5437]: 大电流驱动; ComponentLink1Description: 供应商链接; ComponentLink1URL: http://www.szlcsc.com/product/details_5880.html; Package: SOIC-16_150mil; Supplier: LC; SuppliersPartNumber: C5437
U14 = CMP-0314-00046-2: Remote 16-Bit I2C and SMBus, Low-Power I/O Expander with Interrupt Output, Reset & Config. Register, 1.65 to 5.5 V, -40 to 85 degC, 24-pin QFN (RTW), Green (RoHS & no Sb/Br); Manufacturer: Texas Instruments; Reset Input: Yes; I2C Address: 1110 1xx; # of I/Os: 16; SubFamily: I2C IO Expander; Max Frequency(kHz): 400; Code_JEDEC: MO-220; Low Power: Yes; Push-Pull I/O Type: Yes; 5V Tolerant I/O: Yes; PackageDescription: 24-Lead Plastic Quad FlatPack, No-Lead, 4x4x0.8mm Body [WQFN]; Configuration Registers: Yes; Eco-Plan: Green (RoHS & no Sb/Br); ComponentLink1Description: Datasheet; PartNumber: TCA9539RTWR; PackageReference: RTW0024B; PackageVersion: Jul-04; DatasheetVersion: SCPS202A; Interrupt Output: Yes; Mounting Technology: Surface Mount; ComponentLink1URL: http://www.ti.com/general/docs/lit/getliterature.tsp?genericPartNumber=TCA9539&fileType=pdf; Vcc range(V): 1.65 to 5.5; SuppliersPartNumber: C134039
U15 = RP2040: RP2040 First MCU from RPI
U18 = 74HC14D_[C5605]: 74系列逻辑芯片; ComponentLink1Description: 供应商链接; ComponentLink1URL: http://www.szlcsc.com/product/details_6056.html; Package: SOIC-14_150mil; Supplier: LC; SuppliersPartNumber: C5605
VR1 VR? = SOT-223 AMS1117-3.3: 低压差线性稳压(LDO); ComponentLink1Description: 供应商链接; ComponentLink1URL: http://www.szlcsc.com/product/details_6652.html; Package: SOT-223; Supplier: LC; SuppliersPartNumber: C6186
VR2 = TO-252-2 L78M05ABDT-TR: 12V Linear Reg; ComponentLink1Description: 供应商链接; ComponentLink1URL: http://www.szlcsc.com/product/details_59107.html; Package: TO-252-2; Supplier: digikey; SuppliersPartNumber: C61534
Y1 = YSX321SL: Crystal or Oscillator; Manufacturer_Name: YXC; Datasheet Link: https://datasheet.lcsc.com/szlcsc/YSX321SL-30MHZ-10PF-8PPM_C70576.pdf; Height: 0.8mm; Manufacturer_Part_Number: YSX321SL; SuppliersPartNumber: C9002